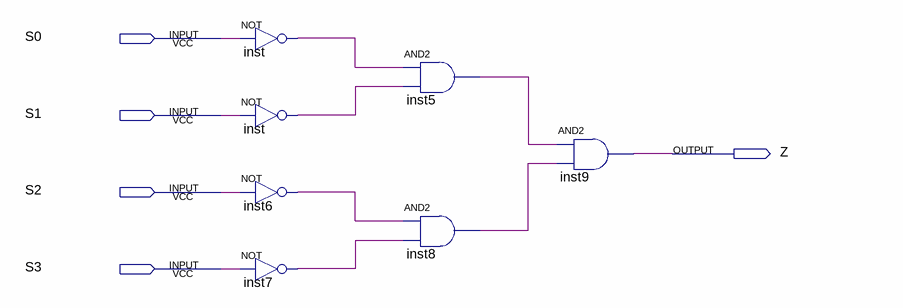
[diagram p0: schematic sheet]
// Quartus schematic Integrador_Quartus.bdf as structural Verilog: 7 symbols, 5 pins
module Integrador_Quartus (
  input  S0,
  input  S1,
  input  S2,
  input  S3,
  output Z
);

  wire inst5_out, inst6_out, inst7_out, inst8_out, inst_out, inst_out_2;

  not inst (inst_out_2, S0);
  not inst_dup2 (inst_out, S1);
  not inst6 (inst6_out, S2);
  not inst7 (inst7_out, S3);
  and inst5 (inst5_out, inst_out_2, inst_out);
  and inst8 (inst8_out, inst6_out, inst7_out);
  and inst9 (Z, inst5_out, inst8_out);
endmodule
